# Altium schematic sheet SS8400C.SchDoc
size A; DocumentNumber: 3; SheetNumber: 3; SheetTotal: 3
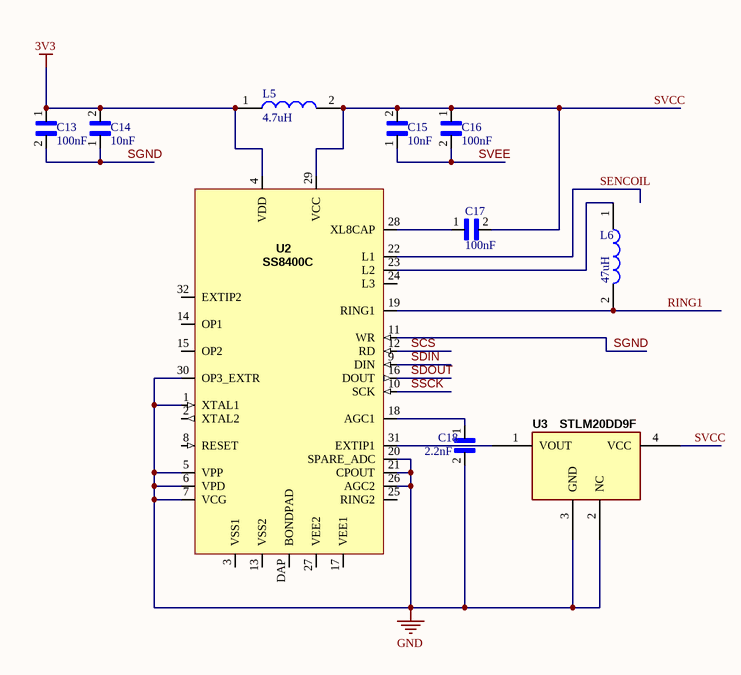
[diagram p0: SS8400C.SchDoc]

## Parts
C13  100nF  [CAPC1608X90N]
C14  10nF  [CAPC1608X90N]
C15  10nF  [CAPC1608X90N]
C16  100nF  [CAPC1608X90N]
C17  100nF  [CAPC1608X90N]
C18  2.2nF  [CAPC1608X90N]
L5  4.7uH  [B82498F]
L6  47uH  [AISC0805F470GT]
U2  SS8400C  [SS8400C_WLCSP]
U3  STLM20DD9F  [QFN55P130X100X55-4N]

## Nets
3V3: C13.1 C14.2 L5.1 U2.4(VDD)
GND: C18.2 U2.1(XTAL1) U2.5(VPP) U2.6(VPD) U2.7(VCG) U2.20(SPARE_ADC) U2.21(CPOUT) U2.26(AGC2) U2.30(OP3_EXTR) U3.2(NC) U3.3(GND)
RING1: L6.2 U2.19(RING1)
SCS: U2.12(RD)
SDIN: U2.9(DIN)
SDOUT: U2.16(DOUT)
SENCOIL: U2.22(L1)
SGND: C13.2 C14.1 U2.11(WR)
SSCK: U2.10(SCK)
SVCC: C15.2 C16.1 C17.2 L5.2 U2.29(VCC) U3.4(VCC)
SVEE: C15.1 C16.2
NetC17_1: C17.1 U2.28(XL8CAP)
NetC18_1: C18.1 U2.18(AGC1)
NetL6_1: L6.1 U2.23(L2)
NetU2_31: U2.31(EXTIP1) U3.1(VOUT)

Not connected (* = marked no-connect by the designer): U2 2(XTAL2) 3(VSS1) 8(RESET) 13(VSS2) 14(OP1) 15(OP2) 17(VEE1) 24(L3) 25(RING2) 27(VEE2) 32(EXTIP2) DAP(BONDPAD)

## Library data of the parts
C13 C16 C17 = 06033G104ZAT2A: 0603 100 nF 25 V -20 / +80 % Tolerance Y5V SMT Multilayer Ceramic Capacitor; Manufacturer: Kyocera AVX; Tolerance: 80%; Voltage Rating (DC): 25V; Insulation Resistance: 100GR; Dissipation Factor: 7%; Supplier 1: Digi-Key; Manufacturer Part Number: 06033G104ZAT2A; RoHS: Yes; Category: Ceramic Capacitors; Stock 1: 1016354; Pricing 1: 1=0.10000, 10=0.03000, 50=0.01660, 100=0.01350, 500=0.00966, 1000=0.00759 (USD); Mount: Surface Mount,PCB; Case/Package: 0603; Number of Pins: 2; Case Code (Imperial): 0603; Case Code (Metric): 1608; Contact Plating: Tin,Matte; Case Code: 0603; Min Operating Temperature: -30°C; Max Operating Temperature: 85°C; Capacitance: 100nF; Dielectric: Y5V; Packaging: Tape and Reel; Package Quantity: 1; Termination: SMD/SMT; Voltage Rating: 25V; Voltage: 25V; Series: -; Construction: Flat; Length: 1.6mm; Width: 0.032inch; Height: 0.9mm; Thickness: 0.035inch; Depth: 0.81mm; Radiation Hardening: No; REACH SVHC: No SVHC; Lead Free: Lead Free; RoHS Compliant: Yes; ComponentLink1URL: https://datasheet.ciiva.com/1124/318409-1124608.pdf?src-supplier=Element14; ComponentLink1Description: https://datasheet.ciiva.com/1124/318409-1124608.pdf?src-supplier=Element14; ComponentLink2URL: https://datasheet.ciiva.com/11786/0900766b802d4699-11786267.pdf?src-supplier=RSComponents; ComponentLink2Description: https://datasheet.ciiva.com/11786/0900766b802d4699-11786267.pdf?src-supplier=RSComponents; ComponentLink3URL: https://datasheet.ciiva.com/2987/cy5v-2987766.pdf?src-supplier=Avnet; ComponentLink3Description: https://datasheet.ciiva.com/2987/cy5v-2987766.pdf?src-supplier=Avnet; ComponentLink4URL: https://datasheet.ciiva.com/11464/cy5v-11464567.pdf?src-supplier=Avnet; ComponentLink4Description: https://datasheet.ciiva.com/11464/cy5v-11464567.pdf?src-supplier=Avnet; ComponentLink5URL: https://datasheet.ciiva.com/16484/cy5v-16484423.pdf?src-supplier=Avnet+Asia; ComponentLink5Description: https://datasheet.ciiva.com/16484/cy5v-16484423.pdf?src-supplier=Avnet+Asia; ComponentLink6URL: https://datasheet.ciiva.com/14590/70001073-14590664.pdf?src-supplier=Allied+Electronics; ComponentLink6Description: https://datasheet.ciiva.com/14590/70001073-14590664.pdf?src-supplier=Allied+Electronics; ComponentLink7URL: https://datasheet.ciiva.com/203/cy5v-203689.pdf?src-supplier=Digi-Key; ComponentLink7Description: https://datasheet.ciiva.com/203/cy5v-203689.pdf?src-supplier=Digi-Key; ComponentLink8URL: https://datasheet.ciiva.com/203/cy5v-203690.pdf?src-supplier=Digi-Key; ComponentLink8Description: https://datasheet.ciiva.com/203/cy5v-203690.pdf?src-supplier=Digi-Key; ComponentLink9URL: https://datasheet.ciiva.com/203/cy5v-203691.pdf?src-supplier=Digi-Key; ComponentLink9Description: https://datasheet.ciiva.com/203/cy5v-203691.pdf?src-supplier=Digi-Key; ComponentLink10URL: https://datasheet.ciiva.com/28613/578190-28613276.pdf?src-supplier=Element14; ComponentLink10Description: https://datasheet.ciiva.com/28613/578190-28613276.pdf?src-supplier=Element14; ComponentLink11URL: https://datasheet.ciiva.com/1124/578190-1124654.pdf?src-supplier=Element14; ComponentLink11Description: https://datasheet.ciiva.com/1124/578190-1124654.pdf?src-supplier=Element14; ComponentLink12URL: https://datasheet.ciiva.com/1124/578190-1124655.pdf?src-supplier=Element14; ComponentLink12Description: https://datasheet.ciiva.com/1124/578190-1124655.pdf?src-supplier=Element14
C14 C15 = 06035C103JAZ2A: 0603 10 nF 50V ±5 % Tolerance X7R Surface Mount Multilayer Ceramic Capacitor; Manufacturer: Kyocera AVX; Tolerance: 5%; Dissipation Factor: 2.5%; Supplier 1: Digi-Key; Manufacturer Part Number: 06035C103JAZ2A; RoHS: Yes; Category: Ceramic Capacitors; Stock 1: 97; Pricing 1: 1=0.14000, 10=0.10200, 50=0.05820, 100=0.04820, 500=0.03378, 1000=0.02797 (USD); Mount: Surface Mount; Case/Package: 0603; Number of Pins: 2; Case Code (Imperial): 0603; Case Code (Metric): 1608; Min Operating Temperature: -55°C; Max Operating Temperature: 125°C; Capacitance: 10nF; Dielectric: X7R; Packaging: Tape and Reel; Voltage Rating (DC): 50V; Package Quantity: 1; Voltage Rating: 50V; Termination: SMD/SMT; Features: Soft Termination; Series: FLEXITERM®; Construction: Flat; Length: 1.6mm; Width: 0.81mm; Height: 0.035mm; Depth: 0.81mm; Thickness: 0.035inch; Radiation Hardening: No; REACH SVHC: No SVHC; Lead Free: Lead Free; RoHS Compliant: Yes; ComponentLink1URL: https://datasheet.ciiva.com/17488/flexiterm-17488982.pdf?src-supplier=Avnet+Europe; ComponentLink1Description: https://datasheet.ciiva.com/17488/flexiterm-17488982.pdf?src-supplier=Avnet+Europe; ComponentLink2URL: https://datasheet.ciiva.com/162/flexiterm-162263.pdf?src-supplier=Digi-Key; ComponentLink2Description: https://datasheet.ciiva.com/162/flexiterm-162263.pdf?src-supplier=Digi-Key; ComponentLink3URL: https://datasheet.ciiva.com/162/flexiterm-162264.pdf?src-supplier=Digi-Key; ComponentLink3Description: https://datasheet.ciiva.com/162/flexiterm-162264.pdf?src-supplier=Digi-Key; ComponentLink4URL: https://datasheet.ciiva.com/162/flexiterm-162265.pdf?src-supplier=Digi-Key; ComponentLink4Description: https://datasheet.ciiva.com/162/flexiterm-162265.pdf?src-supplier=Digi-Key; ComponentLink5URL: https://datasheet.ciiva.com/1124/1679506-1124844.pdf?src-supplier=Element14; ComponentLink5Description: https://datasheet.ciiva.com/1124/1679506-1124844.pdf?src-supplier=Element14; ComponentLink6URL: https://datasheet.ciiva.com/1124/1679506-1124845.pdf?src-supplier=Element14; ComponentLink6Description: https://datasheet.ciiva.com/1124/1679506-1124845.pdf?src-supplier=Element14; ComponentLink7URL: https://datasheet.ciiva.com/11561/flexiterm-11561503.pdf?src-supplier=Avnet; ComponentLink7Description: https://datasheet.ciiva.com/11561/flexiterm-11561503.pdf?src-supplier=Avnet; ComponentLink8URL: https://datasheet.ciiva.com/16327/cx7r-16327071.pdf?src-supplier=Future+Electronics; ComponentLink8Description: https://datasheet.ciiva.com/16327/cx7r-16327071.pdf?src-supplier=Future+Electronics
C18 = 06035C222KAT2A: 0603 2.2 nF 50V ±10 % Tolerance X7R Surface Mount Multilayer Ceramic Capacitor; Manufacturer: Kyocera AVX; Tolerance: 10%; Voltage: 25V; Dissipation Factor: 2.5%; Supplier 1: Digi-Key; Manufacturer Part Number: 06035C222KAT2A; RoHS: Yes; Category: Ceramic Capacitors; Stock 1: 363118; Pricing 1: 1=0.10000, 10=0.06400, 50=0.03500, 100=0.02850, 500=0.02036, 1000=0.01600 (USD); Mount: Surface Mount; Case/Package: 0603; Number of Pins: 2; Case Code (Metric): 1608; Case Code (Imperial): 0603; Contact Plating: Tin,Matte; Dielectric Material: Ceramic; Min Operating Temperature: -55°C; Max Operating Temperature: 125°C; Capacitance: 2.2nF; Dielectric: X7R; Packaging: Tape and Reel; Voltage Rating (DC): 50V; Voltage Rating: 50V; Package Quantity: 1; Termination: SMD/SMT; Series: -; Construction: Flat; Length: 1.6mm; Width: 0.032inch; Height: 0.9mm; Depth: 0.81mm; Thickness: 0.035inch; Radiation Hardening: No; REACH SVHC: No SVHC; Lead Free: Lead Free; RoHS Compliant: Yes; ComponentLink1URL: https://datasheet.ciiva.com/11788/0900766b802d4698-11788065.pdf?src-supplier=RSComponents; ComponentLink1Description: https://datasheet.ciiva.com/11788/0900766b802d4698-11788065.pdf?src-supplier=RSComponents; ComponentLink2URL: https://datasheet.ciiva.com/2987/cx7r-2987841.pdf?src-supplier=Avnet; ComponentLink2Description: https://datasheet.ciiva.com/2987/cx7r-2987841.pdf?src-supplier=Avnet; ComponentLink3URL: https://datasheet.ciiva.com/28546/cx7r-28546597.pdf?src-supplier=Element14; ComponentLink3Description: https://datasheet.ciiva.com/28546/cx7r-28546597.pdf?src-supplier=Element14; ComponentLink4URL: https://datasheet.ciiva.com/160/cx7r-160968.pdf?src-supplier=Digi-Key; ComponentLink4Description: https://datasheet.ciiva.com/160/cx7r-160968.pdf?src-supplier=Digi-Key; ComponentLink5URL: https://datasheet.ciiva.com/160/cx7r-160969.pdf?src-supplier=Digi-Key; ComponentLink5Description: https://datasheet.ciiva.com/160/cx7r-160969.pdf?src-supplier=Digi-Key; ComponentLink6URL: https://datasheet.ciiva.com/160/cx7r-160970.pdf?src-supplier=Digi-Key; ComponentLink6Description: https://datasheet.ciiva.com/160/cx7r-160970.pdf?src-supplier=Digi-Key; ComponentLink7URL: https://datasheet.ciiva.com/1457/1679506-1457930.pdf?src-supplier=Element14; ComponentLink7Description: https://datasheet.ciiva.com/1457/1679506-1457930.pdf?src-supplier=Element14; ComponentLink8URL: https://datasheet.ciiva.com/1457/1679506-1457931.pdf?src-supplier=Element14; ComponentLink8Description: https://datasheet.ciiva.com/1457/1679506-1457931.pdf?src-supplier=Element14; ComponentLink9URL: https://datasheet.ciiva.com/5415/cx7r-218113-5415163.pdf?src-supplier=Mouser; ComponentLink9Description: https://datasheet.ciiva.com/5415/cx7r-218113-5415163.pdf?src-supplier=Mouser
L5 = B82498F1472J000: FIXED IND 4.7UH 90MA 3.8 OHM SMD; Manufacturer: TDK EPCOS; Core Material: Ferrite,Ceramic; Inductance Tolerance: 5%; Q Factor: 20; Self Resonant Frequency: 210MHz; DC Resistance (DCR): 3.8R; Test Frequency: 7.96MHz; Inductor Type: HIGH FREQUENCY; Supplier 1: RSComponents; Manufacturer Part Number: B82498F1472J000; RoHS: Yes; Category: Fixed Inductors; Stock 1: 1; Pricing 1: 10=0.93100, 50=0.79000, 100=0.69900, 250=0.60400, 500=0.55800 (USD); Mount: Surface Mount; Case/Package: 0805; Number of Pins: 2; Case Code (Metric): 2012; Case Code (Imperial): 0805; Contact Plating: Silver; Tolerance: 5%; Packaging: Tape and Reel; Current Rating: 90mA; Inductance: 4.7uH; Max DC Current: 90mA; DC Current: 90mA; Series: SIMID; Series Resistance: 3.8R; Length: 2.3mm; Depth: 1.7mm; REACH SVHC: No SVHC; Military Standard: Not; RoHS Compliant: Yes; ComponentLink1URL: https://datasheet.ciiva.com/6007/78409-6007765.pdf?src-supplier=Farnell; ComponentLink1Description: https://datasheet.ciiva.com/6007/78409-6007765.pdf?src-supplier=Farnell; ComponentLink2URL: https://datasheet.ciiva.com/14124/pjb82498f-data-en-14124805.pdf?src-supplier=Distrelec; ComponentLink2Description: https://datasheet.ciiva.com/14124/pjb82498f-data-en-14124805.pdf?src-supplier=Distrelec
L6 = AISC-0805F-470G-T: Inductor RF Wirewound 47uH 2% 2.5MHz 10Q-Factor Ferrite 0.055A 13.8Ohm DCR 0805 T/R; Manufacturer: Abracon; Self Resonant Frequency: 14MHz; DC Resistance (DCR): 13.8R; Current Rating: 55mA; Shielding: Unshielded; Max DC Current: 1A; Q Factor: 10; Supplier 1: Digi-Key; Manufacturer Part Number: AISC-0805F-470G-T; RoHS: Yes; Category: Fixed Inductors; Stock 1: 1780; Pricing 1: 1=0.29000, 10=0.25700, 25=0.22520, 50=0.19300, 100=0.17690, 250=0.16080, 500=0.15116, 1000=0.11578 (USD); Mount: Surface Mount; Case/Package: 0805; Case Code (Metric): 2012; Case Code (Imperial): 0805; Core Material: Ferrite; Min Operating Temperature: -40°C; Max Operating Temperature: 125°C; Packaging: Tape and Reel; Inductance: 47uH; Tolerance: 2%; Test Frequency: 2.5MHz; Termination: SMD/SMT; Series: AISC-0805F; Package Quantity: 2000; Length: 0.09inch; Width: 0.068inch; Height: 0.061inch; RoHS Compliant: Yes; ComponentLink1URL: https://datasheet.ciiva.com/1079/aisc-0805f-1079476.pdf?src-supplier=Digi-Key; ComponentLink1Description: https://datasheet.ciiva.com/1079/aisc-0805f-1079476.pdf?src-supplier=Digi-Key; ComponentLink2URL: https://datasheet.ciiva.com/1079/aisc-0805f-1079477.pdf?src-supplier=Digi-Key; ComponentLink2Description: https://datasheet.ciiva.com/1079/aisc-0805f-1079477.pdf?src-supplier=Digi-Key
U2 = SS8400-Legacy: Value: SS8400C
U3 = LM20DD9: Ultra-low current 2.4 V precision analog temperature sensor; Manufacturer: STMicroelectronics; Output Type: Analog Voltage,Analog; Output Current: 10mA; Output Voltage: 1.864V; Min Supply Voltage: 2.4V; Max Supply Voltage: 5.5V; Nominal Supply Current: 8uA; Supplier 1: Digi-Key; Manufacturer Part Number: STLM20DD9F; RoHS: Yes; Category: Temperature and Humidity Sensors; Stock 1: 14696; Pricing 1: 1=0.86000, 10=0.75800, 25=0.71240, 100=0.58150, 500=0.45968, 1000=0.38308 (USD); Mount: Surface Mount; Number of Pins: 4; Min Operating Temperature: -40°C; Max Operating Temperature: 85°C; Packaging: Tape and Reel; Package Quantity: 1; Max Supply Voltage (DC): 5.5V; Min Supply Voltage (DC): 2.4V; Operating Supply Current: 8uA; Termination: SMD/SMT; Series: STLM20; Supply Current: 8uA; Length: 1.3mm; Width: 1mm; Height: 0.48mm; Radiation Hardening: No; REACH SVHC: No SVHC; Lead Free: Lead Free; RoHS Compliant: Yes; ComponentLink1URL: https://datasheet.ciiva.com/5299/cd00119601-113824-5299651.pdf?src-supplier=Mouser; ComponentLink1Description: https://datasheet.ciiva.com/5299/cd00119601-113824-5299651.pdf?src-supplier=Mouser; ComponentLink2URL: https://datasheet.ciiva.com/15098/getdatasheetpartid-130260-15098244.pdf?src-supplier=Verical; ComponentLink2Description: https://datasheet.ciiva.com/15098/getdatasheetpartid-130260-15098244.pdf?src-supplier=Verical; ComponentLink3URL: https://datasheet.ciiva.com/2847/cd00119601-2847250.pdf?src-supplier=Digi-Key; ComponentLink3Description: https://datasheet.ciiva.com/2847/cd00119601-2847250.pdf?src-supplier=Digi-Key; ComponentLink4URL: https://datasheet.ciiva.com/2847/cd00119601-2847251.pdf?src-supplier=Digi-Key; ComponentLink4Description: https://datasheet.ciiva.com/2847/cd00119601-2847251.pdf?src-supplier=Digi-Key; ComponentLink5URL: https://datasheet.ciiva.com/2847/cd00119601-2847252.pdf?src-supplier=Digi-Key; ComponentLink5Description: https://datasheet.ciiva.com/2847/cd00119601-2847252.pdf?src-supplier=Digi-Key; ComponentLink6URL: https://datasheet.ciiva.com/22623/1455553-22623973.pdf?src-supplier=Farnell; ComponentLink6Description: https://datasheet.ciiva.com/22623/1455553-22623973.pdf?src-supplier=Farnell; ComponentLink7URL: https://datasheet.ciiva.com/3279/cd00119601-3279974.pdf?src-supplier=Avnet; ComponentLink7Description: https://datasheet.ciiva.com/3279/cd00119601-3279974.pdf?src-supplier=Avnet